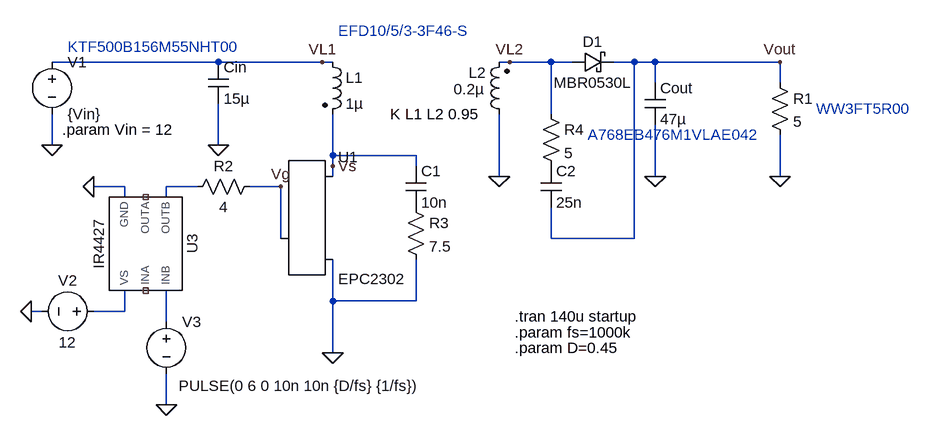
[diagram p0: schematic Flyback_Converter_with_GaN,EPC2302, with IR4427 Gate Driver, snubber on P and S.asc]
Flyback_Converter_with_GaN,EPC2302, with IR4427 Gate Driver, snubber on P and S.asc, the LTspice schematic file:
Version 4
SHEET 1 888 680
WIRE -256 -288 -512 -288
WIRE -96 -288 -256 -288
WIRE -80 -288 -96 -288
WIRE 192 -288 176 -288
WIRE 256 -288 192 -288
WIRE 288 -288 256 -288
WIRE 384 -288 352 -288
WIRE 416 -288 384 -288
WIRE 608 -288 416 -288
WIRE 416 -256 416 -288
WIRE 608 -256 608 -288
WIRE 256 -208 256 -288
WIRE -512 -160 -512 -208
WIRE -256 -160 -256 -224
WIRE -80 -144 -80 -208
WIRE 48 -144 -80 -144
WIRE -80 -128 -80 -144
WIRE 48 -128 48 -144
WIRE -80 -112 -80 -128
WIRE 176 -112 176 -208
WIRE 416 -112 416 -192
WIRE 608 -112 608 -176
WIRE -400 -96 -448 -96
WIRE -288 -96 -336 -96
WIRE -160 -96 -208 -96
WIRE -400 -80 -400 -96
WIRE -336 -80 -336 -96
WIRE -160 -16 -160 -96
WIRE 256 -16 256 -64
WIRE 384 -16 384 -288
WIRE 384 -16 256 -16
WIRE -80 80 -80 16
WIRE 48 80 48 16
WIRE 48 80 -80 80
WIRE -528 96 -544 96
WIRE -400 96 -400 64
WIRE -400 96 -448 96
WIRE -336 112 -336 64
WIRE -80 160 -80 80
WIRE -336 240 -336 192
FLAG 176 -112 0
FLAG 416 -112 0
FLAG 608 -112 0
FLAG -80 160 0
FLAG -512 -160 0
FLAG 608 -288 Vout
FLAG -96 -288 VL1
FLAG 192 -288 VL2
FLAG -256 -160 0
FLAG -544 96 0
FLAG -448 -96 0
FLAG -336 240 0
FLAG -160 -96 Vg
FLAG -80 -128 Vs
SYMBOL ind2 -96 -304 R0
SYMATTR InstName L1
SYMATTR Value 1µ
SYMBOL ind2 192 -192 R180
WINDOW 0 36 80 Left 2
WINDOW 3 39 54 Left 2
SYMATTR InstName L2
SYMATTR Value 0.2µ
SYMBOL voltage -512 -304 R0
WINDOW 123 0 0 Left 0
WINDOW 39 24 44 Left 2
SYMATTR InstName V1
SYMATTR Value {Vin}
SYMBOL schottky 288 -272 R270
WINDOW 0 32 32 VTop 2
WINDOW 3 0 32 VBottom 2
SYMATTR InstName D1
SYMATTR Value MBR0530L
SYMATTR Description Diode
SYMATTR Type diode
SYMBOL cap 400 -256 R0
SYMATTR InstName Cout
SYMATTR Value 47µ
SYMBOL res 592 -272 R0
SYMATTR InstName R1
SYMATTR Value 5
SYMBOL EPCGaN -160 -16 R0
SYMATTR InstName U1
SYMATTR Value EPC2302
SYMBOL cap -272 -288 R0
SYMATTR InstName Cin
SYMATTR Value 15µ
SYMBOL voltage -432 96 R90
WINDOW 0 -32 56 VBottom 2
WINDOW 3 32 56 VTop 2
WINDOW 123 0 0 Left 0
WINDOW 39 0 0 Left 0
SYMATTR InstName V2
SYMATTR Value 12
SYMBOL voltage -336 96 R0
WINDOW 123 0 0 Left 0
WINDOW 39 0 0 Left 0
WINDOW 3 19 115 Left 2
SYMATTR Value PULSE(0 6 0 10n 10n {D/fs} {1/fs})
SYMATTR InstName V3
SYMBOL AutoGenerated\\IR4427 -368 -16 R90
SYMATTR InstName U3
SYMBOL res -192 -112 R90
WINDOW 0 0 56 VBottom 2
WINDOW 3 32 56 VTop 2
SYMATTR InstName R2
SYMATTR Value 4
SYMBOL cap 32 -128 R0
SYMATTR InstName C1
SYMATTR Value 10n
SYMBOL res 32 -80 R0
SYMATTR InstName R3
SYMATTR Value 7.5
SYMBOL res 240 -224 R0
SYMATTR InstName R4
SYMATTR Value 5
SYMBOL cap 240 -128 R0
SYMATTR InstName C2
SYMATTR Value 25n
TEXT 8 -208 Left 2 !K L1 L2 0.95
TEXT -496 -184 Left 2 !.param Vin = 12
TEXT 200 104 Left 2 !.tran 140u startup
TEXT 200 128 Left 2 !.param fs=1000k
TEXT 200 152 Left 2 !.param D=0.45
TEXT -488 -312 Left 2 ;KTF500B156M55NHT00
TEXT -72 -336 Left 2 ;EFD10/5/3-3F46-S
TEXT 664 -216 Left 2 ;WW3FT5R00
TEXT 312 -176 Left 2 ;A768EB476M1VLAE042

The netlist it stands for:
* Flyback_Converter_with_GaN,EPC2302, with IR4427 Gate Driver, snubber on P and S.asc
L1 VL1 Vs 1µ
L2 0 VL2 0.2µ
V1 VL1 0 {Vin}
D1 VL2 Vout MBR0530L
Cout Vout 0 47µ
R1 Vout 0 5
XU1 Vg Vs 0 EPC2302
Cin VL1 0 15µ
V2 N002 0 12
V3 N003 0 PULSE(0 6 0 10n 10n {D/fs} {1/fs})
XU3 N001 NC_01 0 N003 NC_02 N002 IR4427  ; pins OUTB OUTA GND INB INA VS
R2 Vg N001 4
C1 Vs P001 10n
R3 P001 0 7.5
R4 VL2 P002 5
C2 P002 Vout 25n
.model D D
.lib standard.dio
K L1 L2 0.95
.param Vin = 12
.tran 140u startup
.param fs=1000k
.param D=0.45
* KTF500B156M55NHT00
* EFD10/5/3-3F46-S
* WW3FT5R00
* A768EB476M1VLAE042
.lib D:\Users\C1\Documents\C1_Repos\Technion_Project_A\LTSPICE\Components\Libraries\IR4427.lib
.backanno
.end